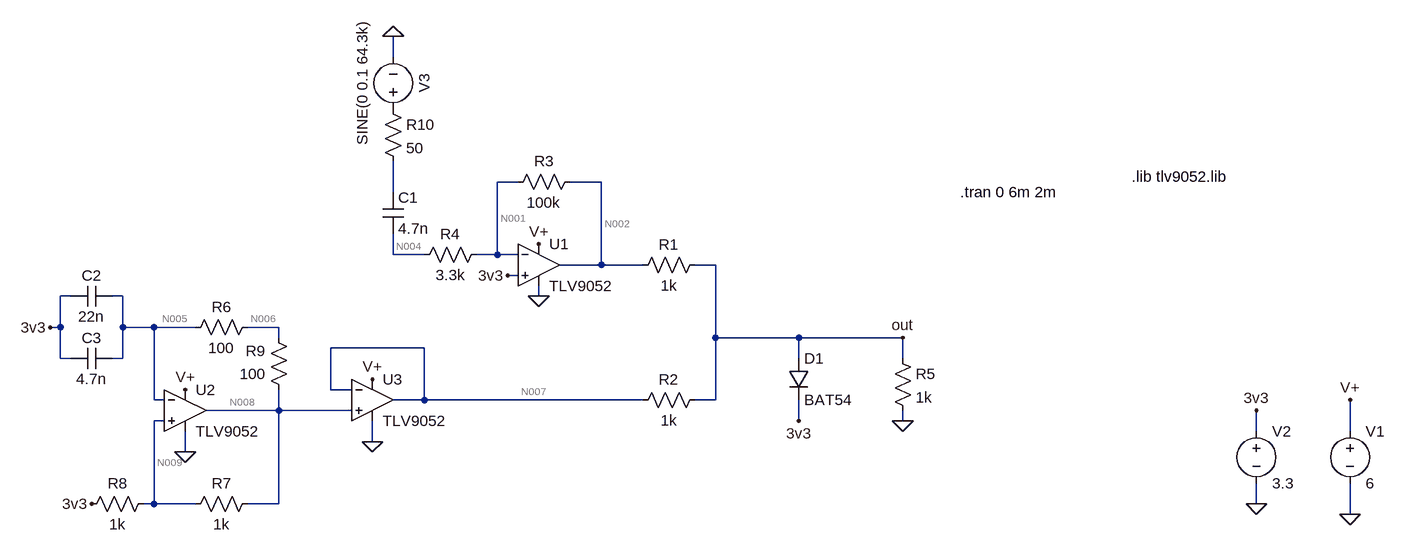
[diagram p0: schematic MixerOscillator.asc]
MixerOscillator.asc, the LTspice schematic file:
Version 4.1
SHEET 1 1368 680
WIRE -384 -320 -384 -352
WIRE -192 -128 -224 -128
WIRE -64 -128 -112 -128
WIRE -384 -112 -384 -160
WIRE -384 -16 -384 -48
WIRE -336 -16 -384 -16
WIRE -224 -16 -224 -128
WIRE -224 -16 -256 -16
WIRE -192 -16 -224 -16
WIRE -64 0 -64 -128
WIRE -64 0 -128 0
WIRE 0 0 -64 0
WIRE 112 0 80 0
WIRE -192 16 -208 16
WIRE -880 48 -896 48
WIRE -800 48 -816 48
WIRE -160 48 -160 32
WIRE -896 96 -896 48
WIRE -896 96 -912 96
WIRE -800 96 -800 48
WIRE -752 96 -800 96
WIRE -688 96 -752 96
WIRE -560 96 -608 96
WIRE -560 112 -560 96
WIRE 112 112 112 0
WIRE 240 112 112 112
WIRE 400 112 240 112
WIRE -336 128 -480 128
WIRE -896 144 -896 96
WIRE -880 144 -896 144
WIRE -800 144 -800 96
WIRE -800 144 -816 144
WIRE 240 144 240 112
WIRE 400 144 400 112
WIRE -480 192 -480 128
WIRE -448 192 -480 192
WIRE -752 208 -752 96
WIRE -736 208 -752 208
WIRE -336 208 -336 128
WIRE -336 208 -384 208
WIRE 0 208 -336 208
WIRE 112 208 112 112
WIRE 112 208 80 208
WIRE -560 224 -560 192
WIRE -560 224 -672 224
WIRE -448 224 -560 224
WIRE -736 240 -752 240
WIRE 240 240 240 208
WIRE 400 240 400 224
WIRE 944 256 944 224
WIRE 1088 256 1088 208
WIRE -416 272 -416 240
WIRE -704 288 -704 256
WIRE -752 368 -752 240
WIRE -752 368 -768 368
WIRE -688 368 -752 368
WIRE -560 368 -560 224
WIRE -560 368 -608 368
WIRE 944 368 944 336
WIRE 1088 384 1088 336
FLAG 1088 208 V+
FLAG 1088 384 0
FLAG 944 224 3v3
FLAG 944 368 0
FLAG -704 192 V+
FLAG -704 288 0
FLAG -848 368 3v3
FLAG -912 96 3v3
FLAG -416 176 V+
FLAG -416 272 0
FLAG -160 -32 V+
FLAG -160 48 0
FLAG -208 16 3v3
FLAG -384 -352 0
FLAG 400 240 0
FLAG 400 112 out
FLAG 240 240 3v3
SYMBOL voltage 1088 240 R0
SYMATTR InstName V1
SYMATTR Value 6
SYMBOL voltage 944 240 R0
SYMATTR InstName V2
SYMATTR Value 3.3
SYMBOL OpAmps\\opamp2 -704 160 R0
SYMATTR InstName U2
SYMATTR Value TLV9052
SYMBOL res -592 80 R90
WINDOW 0 0 56 VBottom 2
WINDOW 3 32 56 VTop 2
SYMATTR InstName R6
SYMATTR Value 100
SYMBOL res -592 352 R90
WINDOW 0 0 56 VBottom 2
WINDOW 3 32 56 VTop 2
SYMATTR InstName R7
SYMATTR Value 1k
SYMBOL res -752 352 R90
WINDOW 0 0 56 VBottom 2
WINDOW 3 32 56 VTop 2
SYMATTR InstName R8
SYMATTR Value 1k
SYMBOL cap -816 32 R90
WINDOW 0 0 32 VBottom 2
WINDOW 3 32 32 VTop 2
SYMATTR InstName C2
SYMATTR Value 22n
SYMBOL res -544 208 R180
WINDOW 0 36 76 Left 2
WINDOW 3 36 40 Left 2
SYMATTR InstName R9
SYMATTR Value 100
SYMBOL cap -816 128 R90
WINDOW 0 0 32 VBottom 2
WINDOW 3 32 32 VTop 2
SYMATTR InstName C3
SYMATTR Value 4.7n
SYMBOL OpAmps\\opamp2 -416 144 R0
SYMATTR InstName U3
SYMATTR Value TLV9052
SYMBOL voltage -384 -224 R180
WINDOW 0 -32 56 VBottom 2
WINDOW 3 32 56 VTop 2
WINDOW 123 0 0 Left 0
WINDOW 39 0 0 Left 0
SYMATTR InstName V3
SYMATTR Value SINE(0 0.1 64.3k)
SYMBOL OpAmps\\opamp2 -160 -64 R0
SYMATTR InstName U1
SYMATTR Value TLV9052
SYMBOL res -96 -144 R90
WINDOW 0 0 56 VBottom 2
WINDOW 3 32 56 VTop 2
SYMATTR InstName R3
SYMATTR Value 100k
SYMBOL res -240 -32 R90
WINDOW 0 0 56 VBottom 2
WINDOW 3 32 56 VTop 2
SYMATTR InstName R4
SYMATTR Value 3.3k
SYMBOL cap -400 -112 R0
SYMATTR InstName C1
SYMATTR Value 4.7n
SYMBOL res -400 -256 R0
SYMATTR InstName R10
SYMATTR Value 50
SYMBOL res 96 -16 R90
WINDOW 0 0 56 VBottom 2
WINDOW 3 32 56 VTop 2
SYMATTR InstName R1
SYMATTR Value 1k
SYMBOL res 96 192 R90
WINDOW 0 0 56 VBottom 2
WINDOW 3 32 56 VTop 2
SYMATTR InstName R2
SYMATTR Value 1k
SYMBOL diode 224 144 R0
SYMATTR InstName D1
SYMATTR Value BAT54
SYMATTR Description Diode
SYMATTR Type diode
SYMBOL res 384 128 R0
SYMATTR InstName R5
SYMATTR Value 1k
TEXT 488 -112 Left 2 !.tran 0 6m 2m
TEXT 752 -136 Left 2 !.lib tlv9052.lib

The netlist it stands for:
* MixerOscillator.asc
V1 V+ 0 6
V2 3v3 0 3.3
X§U2 N009 N005 V+ 0 N008 TLV9052  ; pins In+ In- V+ V- OUT
R6 N006 N005 100
R7 N008 N009 1k
R8 N009 3v3 1k
C2 N005 3v3 22n
R9 N008 N006 100
C3 N005 3v3 4.7n
X§U3 N008 N007 V+ 0 N007 TLV9052  ; pins In+ In- V+ V- OUT
V3 P001 0 SINE(0 0.1 64.3k)
X§U1 3v3 N001 V+ 0 N002 TLV9052  ; pins In+ In- V+ V- OUT
R3 N002 N001 100k
R4 N001 N004 3.3k
C1 N003 N004 4.7n
R10 P001 N003 50
R1 out N002 1k
R2 out N007 1k
D1 out 3v3 BAT54
R5 out 0 1k
.model D D
.lib standard.dio
.tran 0 6m 2m
.lib tlv9052.lib
.backanno
.end

* Results of the author's LTspice run, read from the files saved beside the schematic
* Operating Point, zero values left out:
*   V(3v3) = 3.3 V
*   V(n005) = 3.301 V
*   V(n008) = 3.301 V
*   V(n007) = 3.301 V
*   V(n002) = 3.3 V
*   V(out) = 2.2 V
*   V(v+) = 6 V
*   V(n009) = 3.3 V
*   V(n006) = 3.301 V
*   V(n001) = 3.3 V
*   V(n004) = 3.3 V
*   I(V1) = -3.191 mA
*   I(R6) = 2.575 pA
*   I(R7) = 348 nA
*   I(R3) = 2.537 pA
*   I(R2) = -1.101 mA
*   I(R5) = 2.2 mA
*   I(R8) = 348 nA
*   I(R9) = 2.575 pA
*   I(V2) = 248 nA
*   I(R1) = -1.1 mA
*   I(D1) = -100 nA
*   Ix(u2:in+) = 3.775 pA
*   Ix(u2:in-) = 2.531 pA
*   Ix(u2:vcc) = 330.3 µA
*   Ix(u2:vee) = -330 µA
*   Ix(u2:out) = -348 nA
*   Ix(u3:in+) = 3.819 pA
*   Ix(u3:in-) = 2.442 pA
*   Ix(u3:vcc) = 1.431 mA
*   Ix(u3:vee) = -330 µA
*   Ix(u3:out) = -1.101 mA
*   Ix(u1:in+) = 3.686 pA
*   Ix(u1:in-) = 2.531 pA
*   Ix(u1:vcc) = 1.43 mA
*   Ix(u1:vee) = -330 µA
*   Ix(u1:out) = -1.1 mA